# EAGLE design mainBoard (EAGLE 9.5.2)

## Sheet 1 of 2: Master
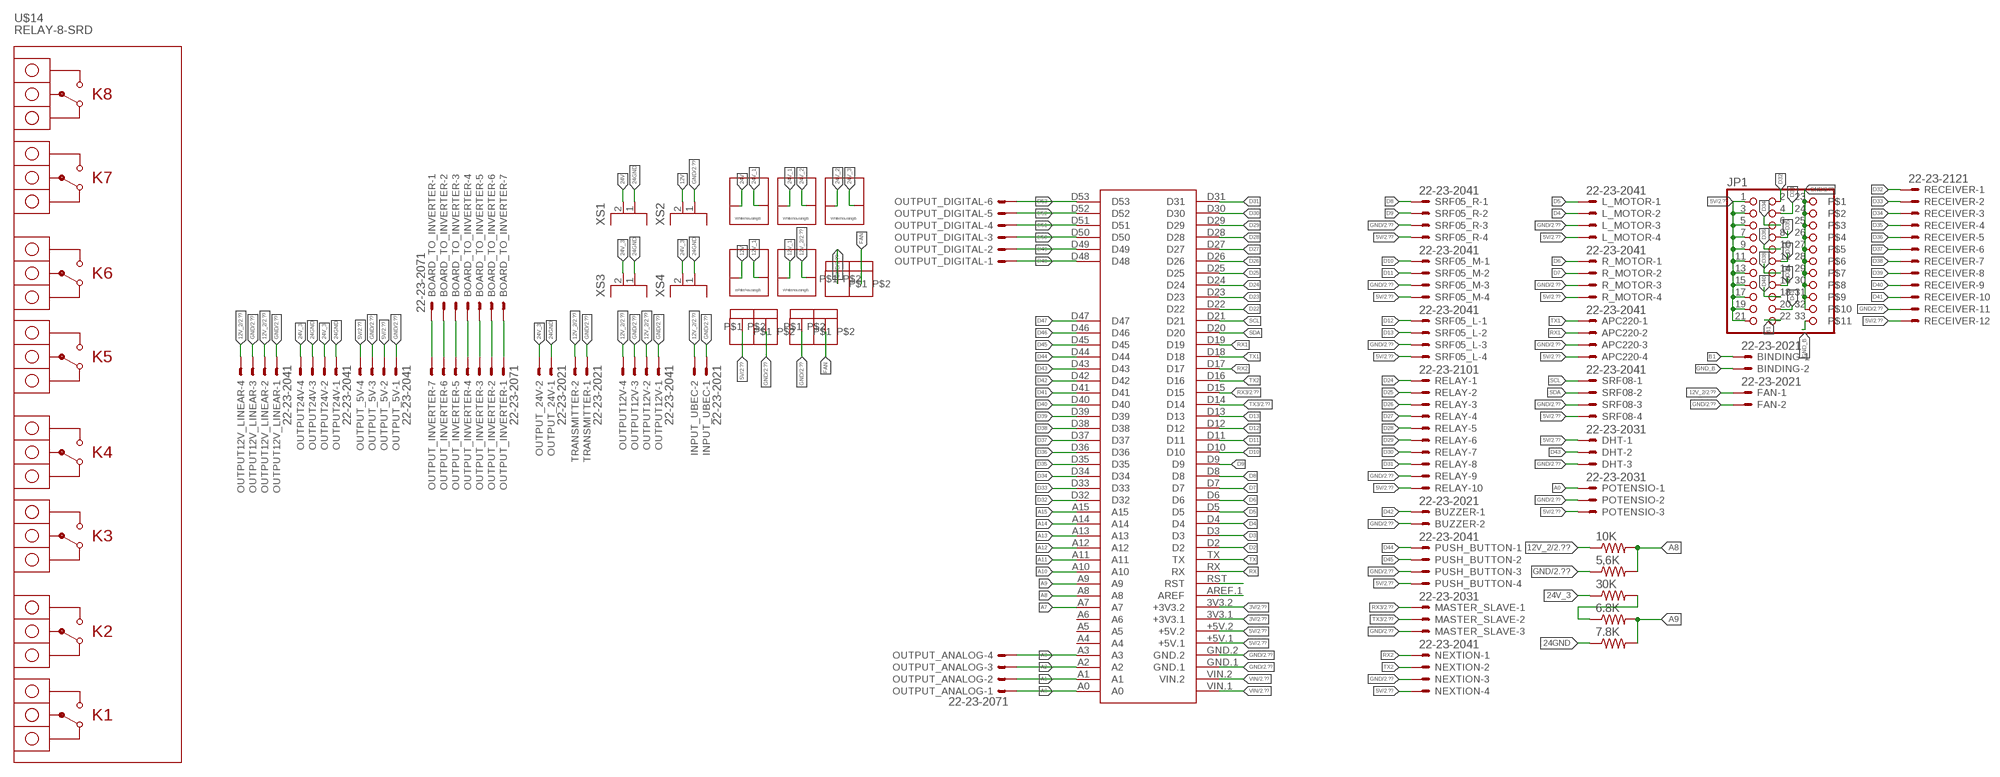
[diagram p0: schematic, sheet 1]

### Parts
5,6K  R-US_0207/7  [0207/7]
6.8K  R-US_0207/7  [0207/7]
7.8K  R-US_0207/7  [0207/7]
10K  R-US_0207/7  [0207/7]
30K  R-US_0207/7  [0207/7]
APC220  22-23-2041  [22-23-2041]
BINDING  22-23-2021  [22-23-2021]
BOARD_TO_INVERTER  22-23-2071  [22-23-2071]
BUZZER  22-23-2021  [22-23-2021]
DHT  22-23-2031  [22-23-2031]
EMERGENCY  WHB  [WHB]
FAN  22-23-2021  [22-23-2021]
FANLEFT  TERMINALBLOCK5MM  [TERMINALBLOCK5MM]
FANRIGHT  TERMINALBLOCK5MM  [TERMINALBLOCK5MM]
FUSE12V  WHB  [WHB]
FUSE24V  WHB  [WHB]
INPUT_UBEC  22-23-2021  [22-23-2021]
JP1  PINHD-2X11  [2X11]
L_MOTOR  22-23-2041  [22-23-2041]
MASTER_SLAVE  22-23-2031  [22-23-2031]
NEXTION  22-23-2041  [22-23-2041]
OUTPUT12V  22-23-2041  [22-23-2041]
OUTPUT12V_LINEAR  22-23-2041  [22-23-2041]
OUTPUT24V  22-23-2041  [22-23-2041]
OUTPUT_5V  22-23-2041  [22-23-2041]
OUTPUT_24V  22-23-2021  [22-23-2021]
OUTPUT_ANALOG  22-23-2071  [22-23-2071]
OUTPUT_DIGITAL  22-23-2061  [22-23-2061]
OUTPUT_INVERTER  22-23-2071  [22-23-2071]
POTENSIO  22-23-2031  [22-23-2031]
PUSH_BUTTON  22-23-2041  [22-23-2041]
R_MOTOR  22-23-2041  [22-23-2041]
RECEIVER  22-23-2121  [22-23-2121]
RELAY  22-23-2101  [22-23-2101]
SRF05_L  22-23-2041  [22-23-2041]
SRF05_M  22-23-2041  [22-23-2041]
SRF05_R  22-23-2041  [22-23-2041]
SRF08  22-23-2041  [22-23-2041]
SWITCH24V  WHB  [WHB]
SWTICH12V  WHB  [WHB]
TRANSMITTER  22-23-2021  [22-23-2021]
U$1  MEGA2560_MIKRO  [MEGA2560_MIKRO]
U$14  RELAY-8-SRD  [RELAY-8-SRD]
UBEC_OUTPUT  TERMINALBLOCK5MM  [TERMINALBLOCK5MM]
XS1  2P  [DG55CB-2P-1]
XS2  2P  [DG55CB-2P-1]
XS3  2P  [DG55CB-2P-1]
XS4  2P  [DG55CB-2P-1]

### Nets
3V: U$1.3V3.1(+3V3.1) U$1.3V3.2(+3V3.2) ; also sheet 2
5V: APC220.4 DHT.1 JP1.1 JP1.3 JP1.5 JP1.7 JP1.9 JP1.11 JP1.13 JP1.15 JP1.17 JP1.19 JP1.21 L_MOTOR.4 NEXTION.4 OUTPUT_5V.2 OUTPUT_5V.4 POTENSIO.3 PUSH_BUTTON.4 R_MOTOR.4 RECEIVER.12 RELAY.10 SRF05_L.4 SRF05_M.4 SRF05_R.4 SRF08.4 U$1.+5V.1 U$1.+5V.2 UBEC_OUTPUT.P$1 ; also sheet 2
12V: FUSE12V.P$1 XS2.2
12V_1: FUSE12V.P$2 SWTICH12V.P$1
12V_2: 10K.1 FAN.1 INPUT_UBEC.2 OUTPUT12V.2 OUTPUT12V.4 OUTPUT12V_LINEAR.2 OUTPUT12V_LINEAR.4 SWTICH12V.P$2 TRANSMITTER.2 ; also sheet 2
24GND: 7.8K.1 OUTPUT24V.1 OUTPUT24V.3 OUTPUT_24V.1 XS1.1 XS3.1 XS4.1
24V: FUSE24V.P$1 XS1.2
24V_1: FUSE24V.P$2 SWITCH24V.P$1
24V_2: EMERGENCY.P$1 SWITCH24V.P$2
24V_3: 30K.1 EMERGENCY.P$2 OUTPUT24V.2 OUTPUT24V.4 OUTPUT_24V.2 XS3.2 XS4.2
A0: OUTPUT_ANALOG.1 POTENSIO.1 U$1.A0
A1: OUTPUT_ANALOG.2 U$1.A1
A2: OUTPUT_ANALOG.3 U$1.A2
A3: OUTPUT_ANALOG.4 U$1.A3
A7: U$1.A7
A8: 5,6K.2 10K.2 U$1.A8
A9: 6.8K.2 7.8K.2 U$1.A9
A10: U$1.A10
A11: U$1.A11
A12: U$1.A12
A13: U$1.A13
A14: U$1.A14
A15: U$1.A15
B1: BINDING.1 JP1.22
D2: U$1.D2
D3: U$1.D3
D4: L_MOTOR.2 U$1.D4
D5: L_MOTOR.1 U$1.D5
D6: R_MOTOR.1 U$1.D6
D7: R_MOTOR.2 U$1.D7
D8: SRF05_R.1 U$1.D8
D9: SRF05_R.2 U$1.D9
D10: SRF05_M.1 U$1.D10
D11: SRF05_M.2 U$1.D11
D12: SRF05_L.1 U$1.D12
D13: SRF05_L.2 U$1.D13
D22: U$1.D22
D23: U$1.D23
D24: RELAY.1 U$1.D24
D25: RELAY.2 U$1.D25
D26: RELAY.3 U$1.D26
D27: RELAY.4 U$1.D27
D28: RELAY.5 U$1.D28
D29: RELAY.6 U$1.D29
D30: RELAY.7 U$1.D30
D31: RELAY.8 U$1.D31
D32: JP1.2 RECEIVER.1 U$1.D32
D33: JP1.4 RECEIVER.2 U$1.D33
D34: JP1.6 RECEIVER.3 U$1.D34
D35: JP1.8 RECEIVER.4 U$1.D35
D36: JP1.10 RECEIVER.5 U$1.D36
D37: JP1.12 RECEIVER.6 U$1.D37
D38: JP1.14 RECEIVER.7 U$1.D38
D39: JP1.16 RECEIVER.8 U$1.D39
D40: JP1.18 RECEIVER.9 U$1.D40
D41: JP1.20 RECEIVER.10 U$1.D41
D42: BUZZER.1 U$1.D42
D43: DHT.2 U$1.D43
D44: PUSH_BUTTON.1 U$1.D44
D45: PUSH_BUTTON.2 U$1.D45
D46: U$1.D46
D47: U$1.D47
D48: OUTPUT_DIGITAL.1 U$1.D48
D49: OUTPUT_DIGITAL.2 U$1.D49
D50: OUTPUT_DIGITAL.3 U$1.D50
D51: OUTPUT_DIGITAL.4 U$1.D51
D52: OUTPUT_DIGITAL.5 U$1.D52
D53: OUTPUT_DIGITAL.6 U$1.D53
FAN: FANLEFT.P$2 FANRIGHT.P$2
GND: 5,6K.1 APC220.3 BUZZER.2 DHT.3 FAN.2 FANLEFT.P$1 FANRIGHT.P$1 INPUT_UBEC.1 JP1.23 JP1.24 JP1.25 JP1.26 JP1.27 JP1.28 JP1.29 JP1.30 JP1.31 JP1.32 L_MOTOR.3 MASTER_SLAVE.3 NEXTION.3 OUTPUT12V.1 OUTPUT12V.3 OUTPUT12V_LINEAR.1 OUTPUT12V_LINEAR.3 OUTPUT_5V.1 OUTPUT_5V.3 POTENSIO.2 PUSH_BUTTON.3 R_MOTOR.3 RECEIVER.11 RELAY.9 SRF05_L.3 SRF05_M.3 SRF05_R.3 SRF08.3 TRANSMITTER.1 U$1.GND.1 U$1.GND.2 UBEC_OUTPUT.P$2 XS2.1 ; also sheet 2
GND_B: BINDING.2 JP1.33
N$3: 6.8K.1 30K.2
N$5: BOARD_TO_INVERTER.1 OUTPUT_INVERTER.7
N$6: BOARD_TO_INVERTER.2 OUTPUT_INVERTER.6
N$7: BOARD_TO_INVERTER.3 OUTPUT_INVERTER.5
N$8: BOARD_TO_INVERTER.4 OUTPUT_INVERTER.4
N$9: BOARD_TO_INVERTER.5 OUTPUT_INVERTER.3
N$10: BOARD_TO_INVERTER.6 OUTPUT_INVERTER.2
N$11: BOARD_TO_INVERTER.7 OUTPUT_INVERTER.1
N$33: U$1.RST
N$34: U$1.AREF.1(AREF)
RX: U$1.RX
RX1: APC220.2 U$1.D19
RX2: NEXTION.1 U$1.D17
RX3: MASTER_SLAVE.1 U$1.D15 ; also sheet 2
SCL: SRF08.1 U$1.D21
SDA: SRF08.2 U$1.D20
TX: U$1.TX
TX1: APC220.1 U$1.D18
TX2: NEXTION.2 U$1.D16
TX3: MASTER_SLAVE.2 U$1.D14 ; also sheet 2
VIN: U$1.VIN.1 U$1.VIN.2 ; also sheet 2
Unconnected: OUTPUT_ANALOG.5 OUTPUT_ANALOG.6 OUTPUT_ANALOG.7 U$1.A4 U$1.A5 U$1.A6

## Sheet 2 of 2: SLAVE
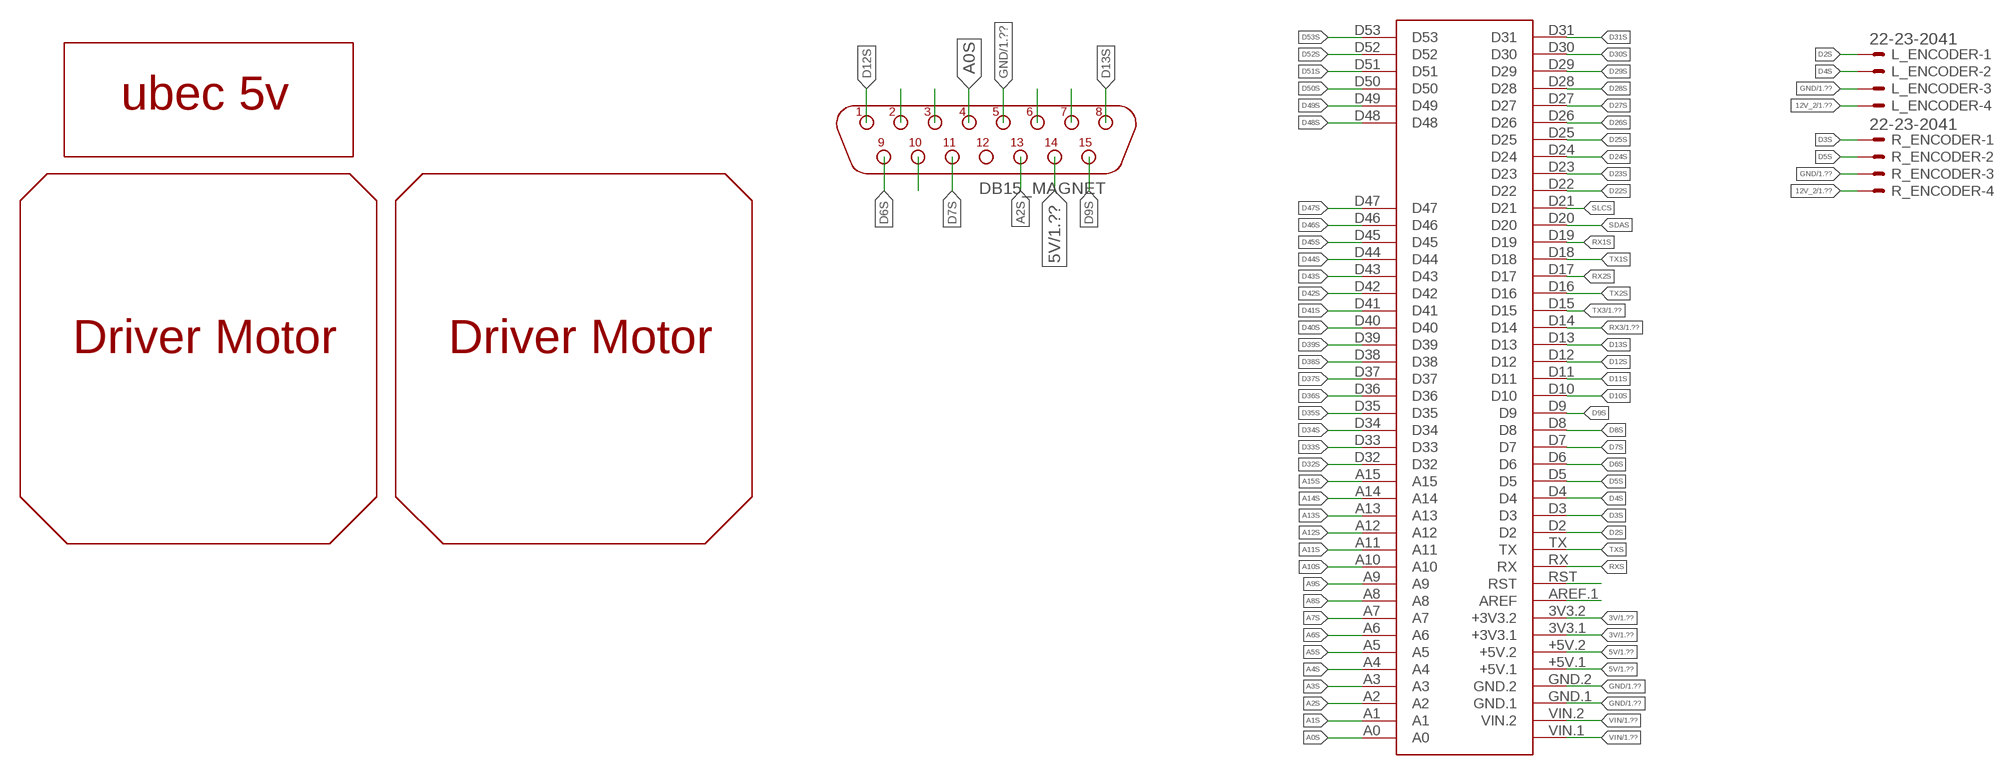
[diagram p1: schematic, sheet 2]

### Parts
DB15_MAGNET  DB15M/90  [D-15M/90]
L_ENCODER  22-23-2041  [22-23-2041]
R_ENCODER  22-23-2041  [22-23-2041]
U$2  MEGA2560_MIKRO  [MEGA2560_MIKRO]
U$11  BT2  [IBT2]
U$12  BT2  [IBT2]
U$13  UBEC  [AD]

### Nets
3V: U$2.3V3.1(+3V3.1) U$2.3V3.2(+3V3.2) ; also sheet 1
5V: DB15_MAGNET.14 U$2.+5V.1 U$2.+5V.2 ; also sheet 1
12V_2: L_ENCODER.4 R_ENCODER.4 ; also sheet 1
A0S: DB15_MAGNET.4 U$2.A0
A1S: U$2.A1
A2S: DB15_MAGNET.13 U$2.A2
A3S: U$2.A3
A4S: U$2.A4
A5S: U$2.A5
A6S: U$2.A6
A7S: U$2.A7
A8S: U$2.A8
A9S: U$2.A9
A10S: U$2.A10
A11S: U$2.A11
A12S: U$2.A12
A13S: U$2.A13
A14S: U$2.A14
A15S: U$2.A15
D2S: L_ENCODER.1 U$2.D2
D3S: R_ENCODER.1 U$2.D3
D4S: L_ENCODER.2 U$2.D4
D5S: R_ENCODER.2 U$2.D5
D6S: DB15_MAGNET.9 U$2.D6
D7S: DB15_MAGNET.11 U$2.D7
D8S: U$2.D8
D9S: DB15_MAGNET.15 U$2.D9
D10S: U$2.D10
D11S: U$2.D11
D12S: DB15_MAGNET.1 U$2.D12
D13S: DB15_MAGNET.8 U$2.D13
D22S: U$2.D22
D23S: U$2.D23
D24S: U$2.D24
D25S: U$2.D25
D26S: U$2.D26
D27S: U$2.D27
D28S: U$2.D28
D29S: U$2.D29
D30S: U$2.D30
D31S: U$2.D31
D32S: U$2.D32
D33S: U$2.D33
D34S: U$2.D34
D35S: U$2.D35
D36S: U$2.D36
D37S: U$2.D37
D38S: U$2.D38
D39S: U$2.D39
D40S: U$2.D40
D41S: U$2.D41
D42S: U$2.D42
D43S: U$2.D43
D44S: U$2.D44
D45S: U$2.D45
D46S: U$2.D46
D47S: U$2.D47
D48S: U$2.D48
D49S: U$2.D49
D50S: U$2.D50
D51S: U$2.D51
D52S: U$2.D52
D53S: U$2.D53
GND: DB15_MAGNET.5 L_ENCODER.3 R_ENCODER.3 U$2.GND.1 U$2.GND.2 ; also sheet 1
N$1: U$2.RST
N$2: U$2.AREF.1(AREF)
N$4: DB15_MAGNET.3
N$20: DB15_MAGNET.2
N$25: DB15_MAGNET.6
N$26: DB15_MAGNET.7
N$41: DB15_MAGNET.10
RX1S: U$2.D19
RX2S: U$2.D17
RX3: U$2.D14 ; also sheet 1
RXS: U$2.RX
SDAS: U$2.D20
SLCS: U$2.D21
TX1S: U$2.D18
TX2S: U$2.D16
TX3: U$2.D15 ; also sheet 1
TXS: U$2.TX
VIN: U$2.VIN.1 U$2.VIN.2 ; also sheet 1
Unconnected: DB15_MAGNET.12

## Library data of the parts
5,6K 6.8K 7.8K 10K 30K = rcl:R-US_: RESISTOR, American symbol; SPICEPREFIX: R
APC220 L_ENCODER L_MOTOR NEXTION OUTPUT12V OUTPUT12V_LINEAR OUTPUT24V OUTPUT_5V PUSH_BUTTON R_ENCODER R_MOTOR SRF05_L SRF05_M SRF05_R SRF08 = con-molex:22-23-2041: .100" (2.54mm) Center Header - 4 Pin; MF: MOLEX; MPN: 22-23-2041; OC_FARNELL: 1462920; OC_NEWARK: 38C0355
BINDING BUZZER FAN INPUT_UBEC OUTPUT_24V TRANSMITTER = con-molex:22-23-2021: .100" (2.54mm) Center Header - 2 Pin; MF: MOLEX; MPN: 22-23-2021; OC_FARNELL: 1462926; OC_NEWARK: 25C3832
BOARD_TO_INVERTER OUTPUT_ANALOG OUTPUT_INVERTER = con-molex:22-23-2071: .100" (2.54mm) Center Header - 7 Pin; MF: MOLEX; MPN: 22-23-2071; OC_FARNELL: 1654534; OC_NEWARK: 56H0445
DB15_MAGNET = connect:DB15M/90
DHT MASTER_SLAVE POTENSIO = con-molex:22-23-2031: .100" (2.54mm) Center Header - 3 Pin; MF: MOLEX; MPN: 22-23-2031; OC_FARNELL: 1462950; OC_NEWARK: 30C0862
EMERGENCY FUSE12V FUSE24V SWITCH24V SWTICH12V = WhiteHousingB:WHB
FANLEFT FANRIGHT UBEC_OUTPUT = terminal5mm:TERMINALBLOCK5MM
JP1 = pinhead:PINHD-2X11: PIN HEADER
OUTPUT_DIGITAL = con-molex:22-23-2061: .100" (2.54mm) Center Header - 6 Pin; MF: MOLEX; MPN: 22-23-2061; OC_FARNELL: 1462922; OC_NEWARK: 27C1933
RECEIVER = con-molex:22-23-2121: .100" (2.54mm) Center Header - 12 Pin; MF: MOLEX; MPN: 22-23-2121; OC_FARNELL: 1462935; OC_NEWARK: 56H0456
RELAY = con-molex:22-23-2101: .100" (2.54mm) Center Header - 10 Pin; MF: MOLEX; MPN: 22-23-2101; OC_FARNELL: 1756828; OC_NEWARK: 94C0765
U$1 U$2 = MIKRO_MEGA2560:MEGA2560_MIKRO: Arduino Mega2560 pro robotDyn, create by mikroavr.com
U$11 U$12 = bt2DM:BT2
U$13 = UBEC:UBEC
U$14 = diy-modules:RELAY-8-SRD: 8-Channel Relay Module based on SRD-05VDC-SL-C relays Click here to find device on ebay.com <http://www.ebay.com/sch/eight+channel+relay+module+optocoupler+5v>
XS1-XS4 = con-dg55:2P: DEGSON DG55 CONNECTOR

## Board
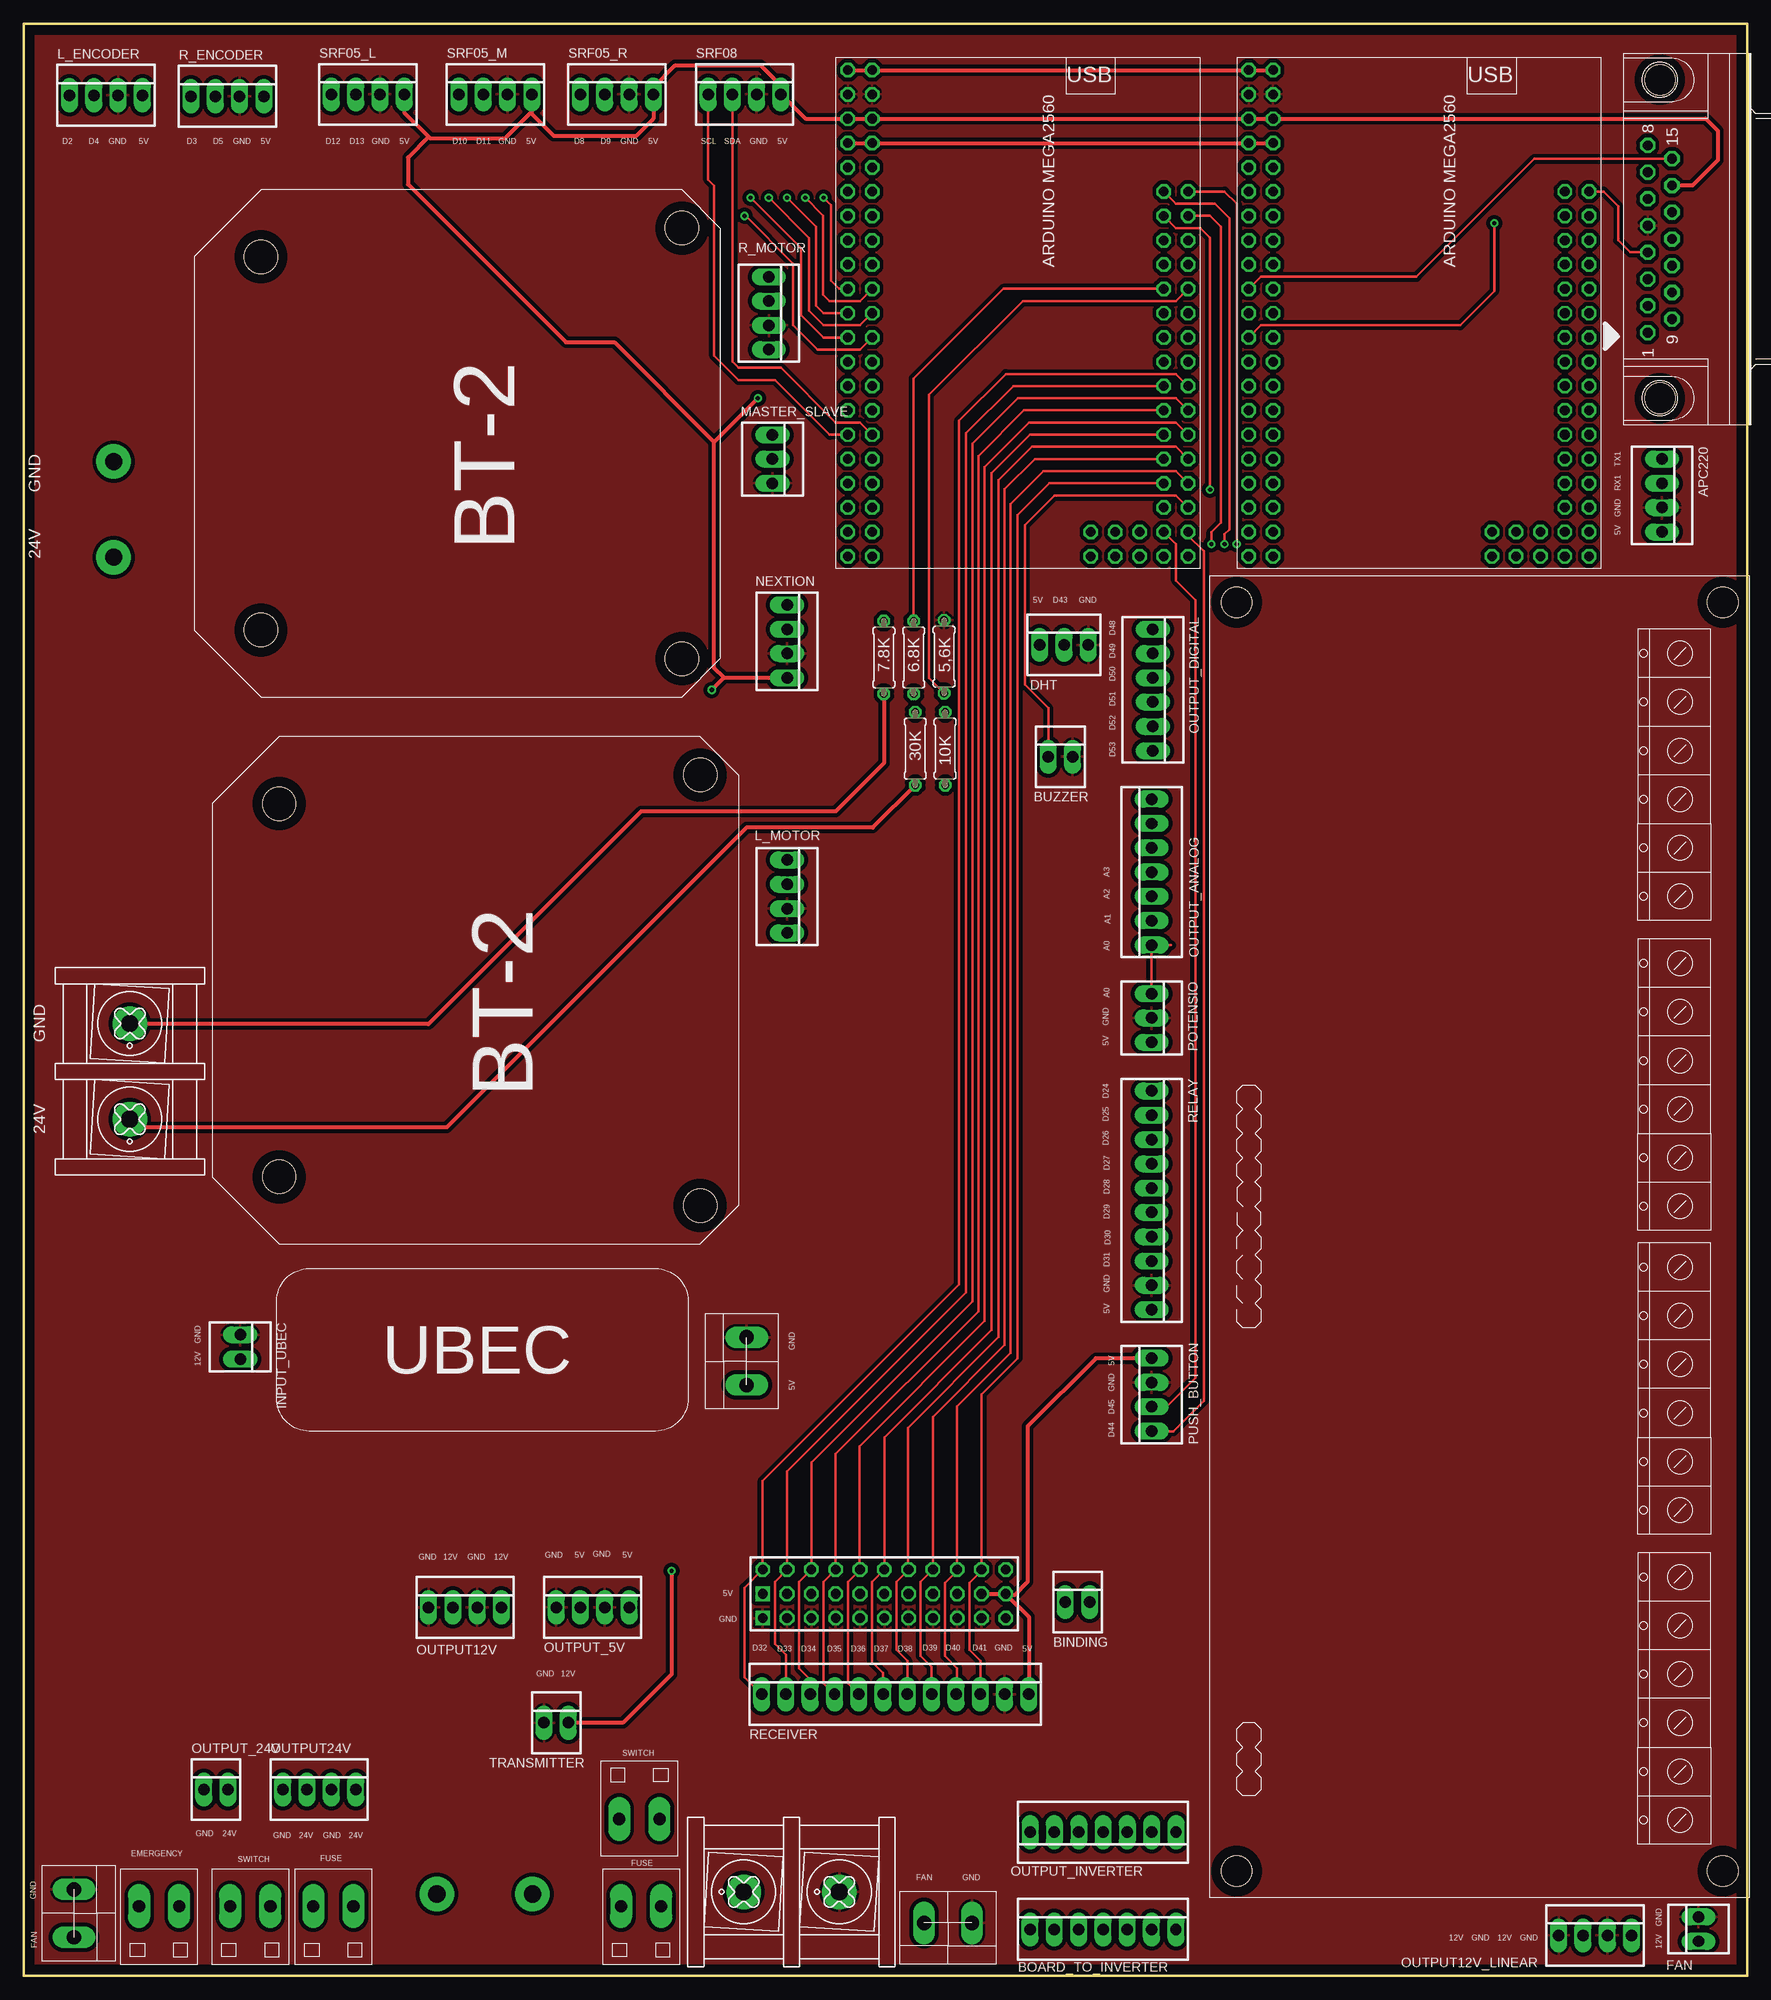
[diagram p2: board, top side]
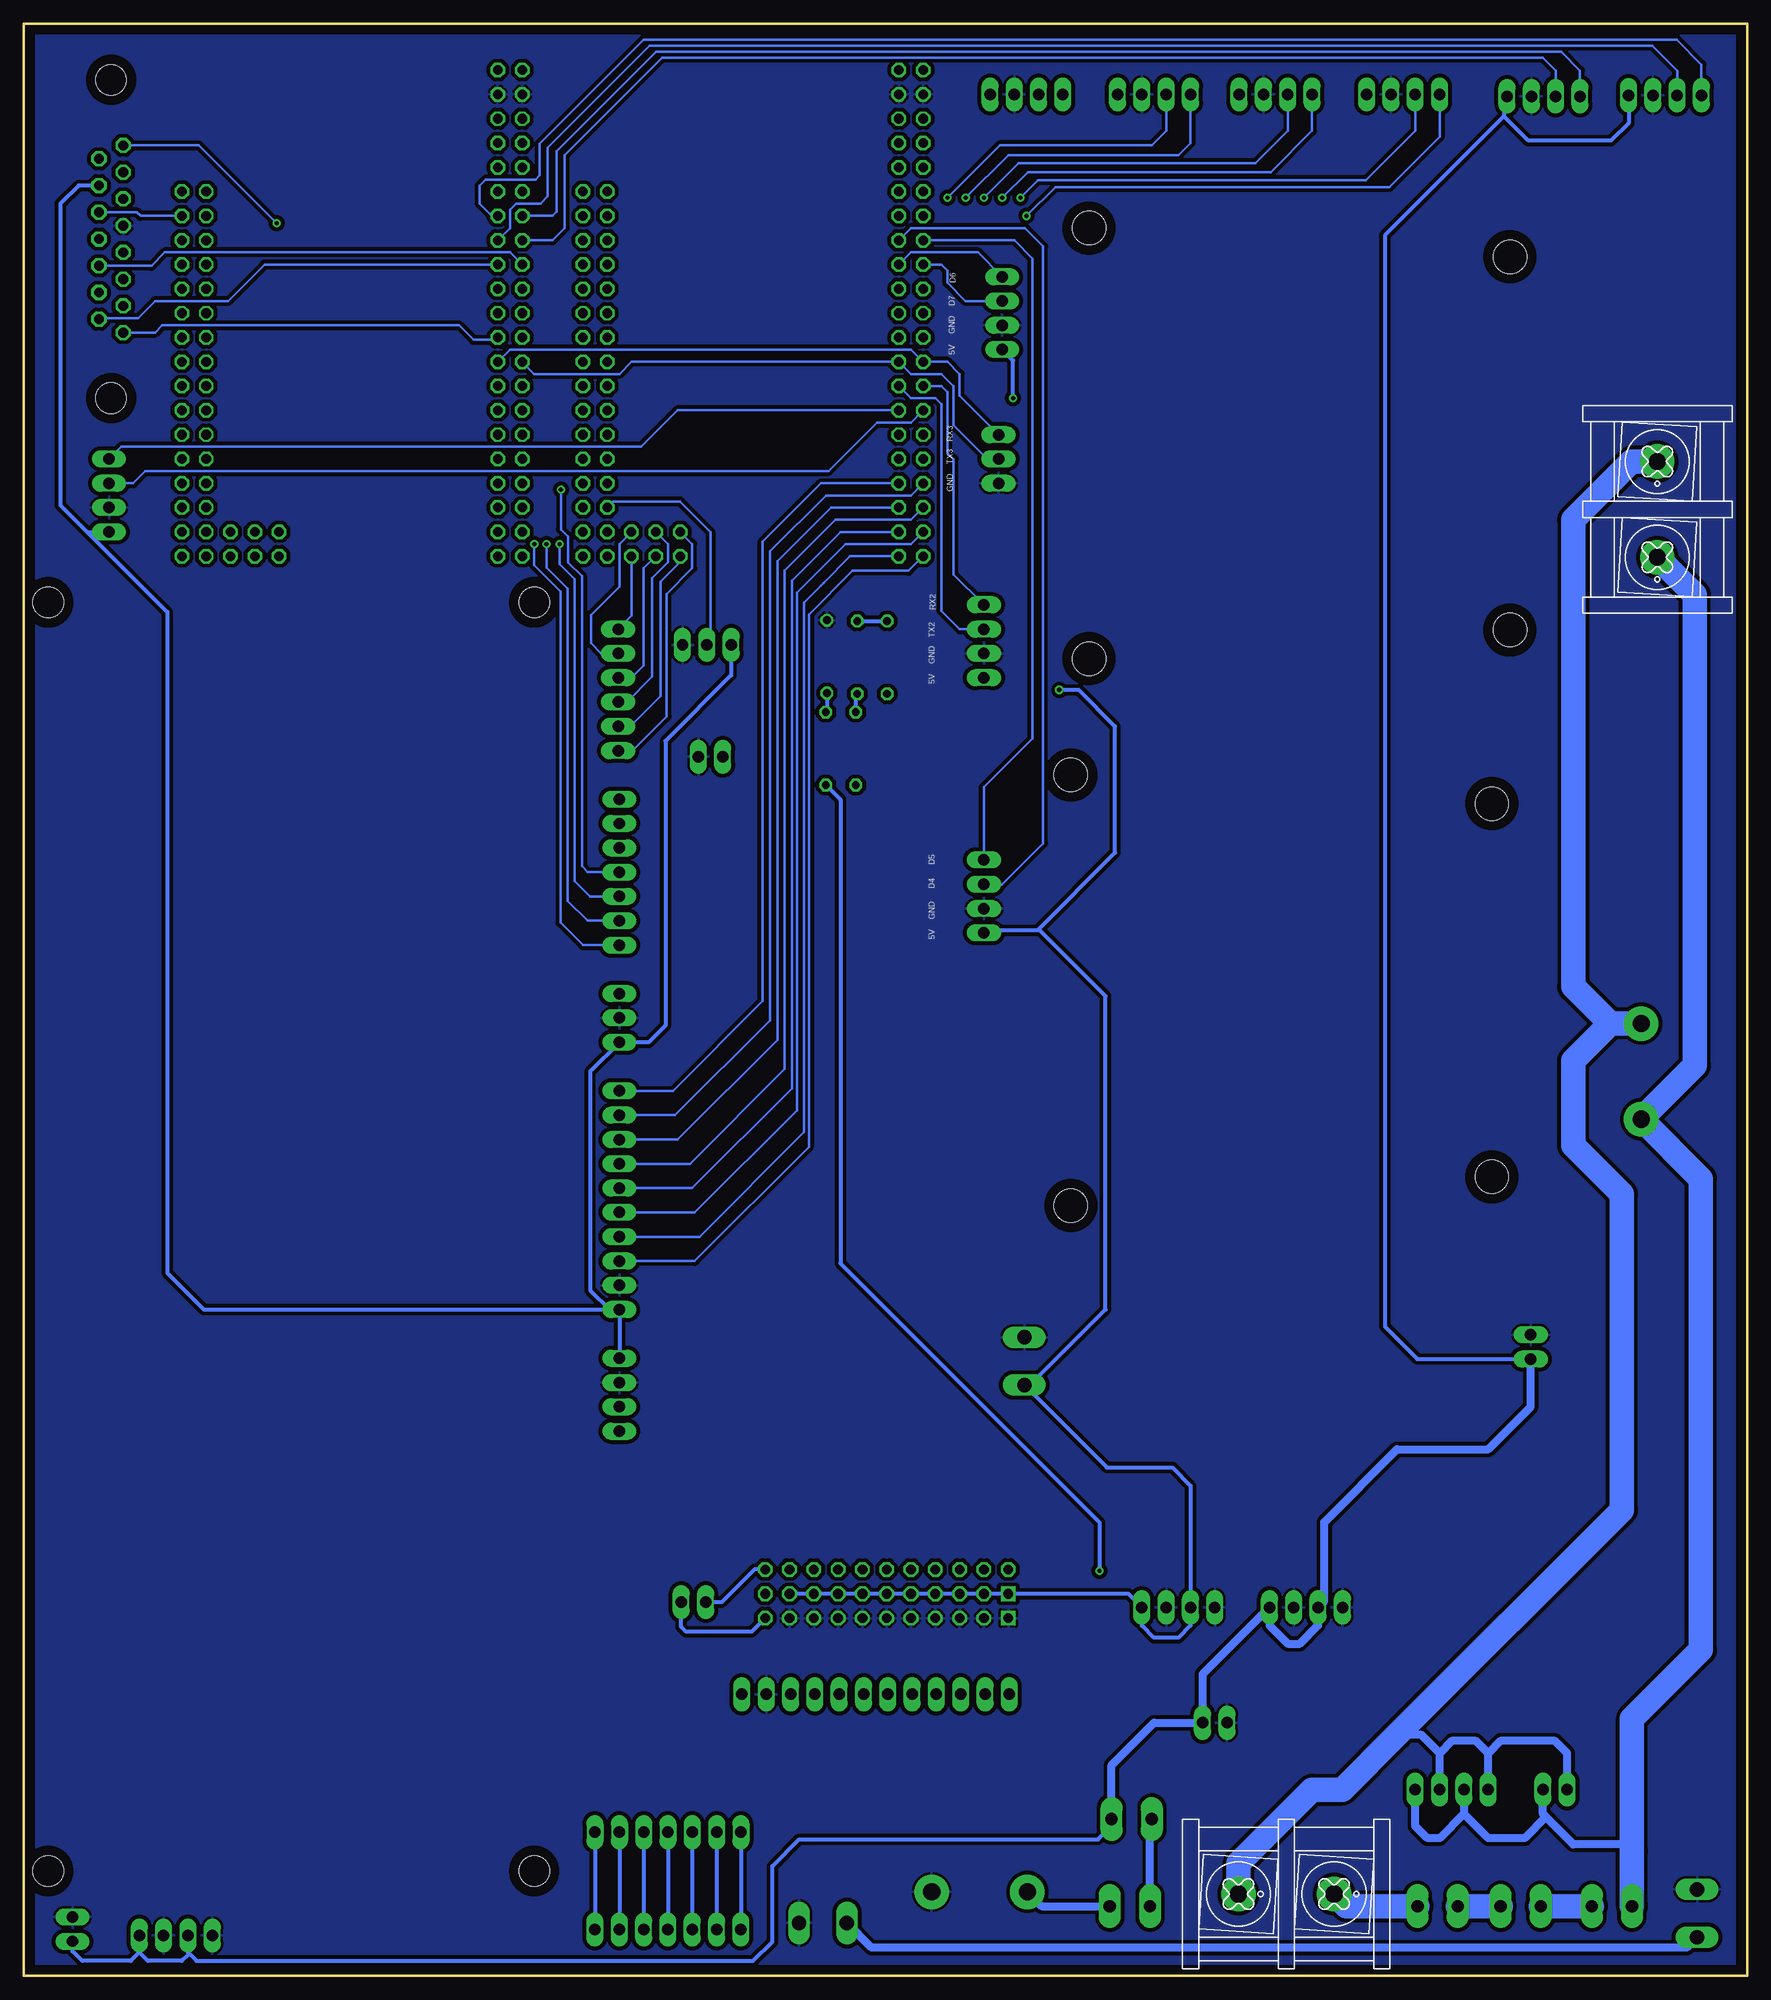
[diagram p3: board, bottom side, seen from below]

Size 180.09 x 203.96 mm. Coordinates in mm from the lower left corner, seen from the top.
Outline: 0,203.96 180.09,203.96 180.09,0 0,0 0,203.96
Copper layers (1*16): Top 0.035mm / dielectric 1.5mm / Bottom 0.035mm
Design rules "default": minimum track width 6mil, minimum drill 0.35mm, track to track 6mil, track to pad 6mil, pad to pad 6mil, via to via 6mil, smd to smd 6mil, copper to edge 40mil, drill to drill 6mil, minimum pad ring 10mil, minimum via ring 8mil, stop-mask expansion 4mil, vias tented up to drill 0mil, thermal gap 10mil

### Footprints (pad centres in the part's own frame; a part is rotated, then mirrored left to right if it is on the bottom)
0207/7 = drill 0.813 octagon: 1 -3.81,0; 2 3.81,0
22-23-2041 = drill 1.2 long: 1 -3.81,0; 2 -1.27,0; 3 1.27,0; 4 3.81,0
22-23-2021 = drill 1.2 long: 1 -1.27,0; 2 1.27,0
22-23-2071 = drill 1.2 long: 1 -7.62,0; 2 -5.08,0; 3 -2.54,0; 4 0,0; 5 2.54,0; 6 5.08,0; 7 7.62,0
D-15M/90 = drill 1.016 pad 1.575 octagon: 1 9.779,-1.27; 2 6.985,-1.27; 3 4.191,-1.27; 4 1.397,-1.27; 5 -1.397,-1.27; 6 -4.191,-1.27; 7 -6.985,-1.27; 8 -9.779,-1.27; 9 8.382,1.27; 10 5.588,1.27; 11 2.794,1.27; 12 0,1.27; 13 -2.794,1.27; 14 -5.588,1.27; 15 -8.382,1.27 | hole 3.2: 16.637,0; -16.637,0
22-23-2031 = drill 1.2 long: 1 -2.54,0; 2 0,0; 3 2.54,0
WHB = drill 1.27 pad 2.286 long: P$1 1.9,-6.1; P$2 6.1,-6.1
TERMINALBLOCK5MM = drill 1.5 long: P$1 0,0; P$2 5,0
2X11 = drill 1.016 square: 1 -12.7,-1.27; 23 -12.7,-3.81 | drill 1.016 octagon: 2 -12.7,1.27; 3 -10.16,-1.27; 4 -10.16,1.27; 5 -7.62,-1.27; 6 -7.62,1.27; 7 -5.08,-1.27; 8 -5.08,1.27; 9 -2.54,-1.27; 10 -2.54,1.27; 11 0,-1.27; 12 0,1.27; 13 2.54,-1.27; 14 2.54,1.27; 15 5.08,-1.27; 16 5.08,1.27; 17 7.62,-1.27; 18 7.62,1.27; 19 10.16,-1.27; 20 10.16,1.27; 21 12.7,-1.27; 22 12.7,1.27; 24 -10.16,-3.81; 25 -7.62,-3.81; 26 -5.08,-3.81; 27 -2.54,-3.81; 28 0,-3.81; 29 2.54,-3.81; 30 5.08,-3.81; 31 7.62,-3.81; 32 10.16,-3.81; 33 12.7,-3.81
22-23-2061 = drill 1.2 long: 1 -6.35,0; 2 -3.81,0; 3 -1.27,0; 4 1.27,0; 5 3.81,0; 6 6.35,0
22-23-2121 = drill 1.2 long: 1 -13.97,0; 2 -11.43,0; 3 -8.89,0; 4 -6.35,0; 5 -3.81,0; 6 -1.27,0; 7 1.27,0; 8 3.81,0; 9 6.35,0; 10 8.89,0; 11 11.43,0; 12 13.97,0
22-23-2101 = drill 1.2 long: 1 -11.43,0; 2 -8.89,0; 3 -6.35,0; 4 -3.81,0; 5 -1.27,0; 6 1.27,0; 7 3.81,0; 8 6.35,0; 9 8.89,0; 10 11.43,0
MEGA2560_MIKRO = drill 1 octagon: 3V3.1 -26.67,-17.78; 3V3.2 -26.67,-20.32; +5V.1 -29.21,-17.78; +5V.2 -29.21,-20.32; A0 -21.59,15.24; A1 -21.59,12.7; A2 -19.05,15.24; A3 -19.05,12.7; A4 -16.51,15.24; A5 -16.51,12.7; A6 -13.97,15.24; A7 -13.97,12.7; A8 -11.43,15.24; A9 -11.43,12.7; A10 -8.89,15.24; A11 -8.89,12.7; A12 -6.35,15.24; A13 -6.35,12.7; A14 -3.81,15.24; A15 -3.81,12.7; AREF.1 -24.13,-17.78; D2 -19.05,-17.78; D3 -19.05,-20.32; D4 -16.51,-17.78; D5 -16.51,-20.32; D6 -13.97,-17.78; D7 -13.97,-20.32; D8 -11.43,-17.78; D9 -11.43,-20.32; D10 -8.89,-17.78; D11 -8.89,-20.32; D12 -6.35,-17.78; D13 -6.35,-20.32; D14 -3.81,-17.78; D15 -3.81,-20.32; D16 -1.27,-17.78; D17 -1.27,-20.32; D18 1.27,-17.78; D19 1.27,-20.32; D20 3.81,-17.78; D21 3.81,-20.32; D22 6.35,-17.78; D23 6.35,-20.32; D24 8.89,-17.78; D25 8.89,-20.32; D26 11.43,-17.78; D27 11.43,-20.32; D28 13.97,-17.78; D29 13.97,-20.32; D30 16.51,-17.78; D31 16.51,-20.32; D32 -1.27,15.24; D33 -1.27,12.7; D34 1.27,15.24; D35 1.27,12.7; D36 3.81,15.24; D37 3.81,12.7; D38 6.35,15.24; D39 6.35,12.7; D40 8.89,15.24; D41 8.89,12.7; D42 11.43,15.24; D43 11.43,12.7; D44 13.97,15.24; D45 13.97,12.7; D46 16.51,15.24; D47 16.51,12.7; D48 16.51,10.16; D49 13.97,10.16; D50 16.51,7.62; D51 13.97,7.62; D52 16.51,5.08; D53 13.97,5.08; GND.1 -31.75,-17.78; GND.2 -31.75,-20.32; RST -24.13,-20.32; RX -21.59,-17.78; TX -21.59,-20.32; VIN.1 -34.29,-17.78; VIN.2 -34.29,-20.32
IBT2 = hole 3.5: 0,-4; 45,-4; 42,-48; 3,-48
RELAY-8-SRD = hole 3.2: -25.4,66.294; 25.4,66.294; 25.4,-66.294; -25.4,-66.294
DG55CB-2P-1 = drill 1.8 pad 3.6: 1 -5,0; 2 5,0

### Placement (x,y rotation side)
5,6K  96.17,137.84 270 top
6.8K  92.99,137.75 90 top
7.8K  89.87,137.75 90 top
10K  96.28,128.23 90 top
30K  93.16,128.23 90 top
APC220  171.2,154.69 270 top
BINDING  110.12,39.03 0 top
BOARD_TO_INVERTER  112.78,4.83 0 top
BUZZER  108.33,127.38 0 top
DB15_MAGNET  170.98,181.49 270 top
DHT  108.71,139.06 0 top
EMERGENCY  18.13,1.16 180 top
FAN  175.01,4.86 90 top
FANLEFT  99.08,5.5 180 top
FANRIGHT  5.22,9 270 top
FUSE12V  68.51,1.16 180 top
FUSE24V  36.34,1.16 180 top
INPUT_UBEC  22.61,65.71 270 top
JP1  89.92,41.17 0 top
L_ENCODER  8.58,196.51 0 top
L_MOTOR  79.76,112.78 270 top
MASTER_SLAVE  78.23,158.5 270 top
NEXTION  79.76,139.45 270 top
OUTPUT12V  46.1,38.48 0 top
OUTPUT12V_LINEAR  164.21,4.19 0 top
OUTPUT24V  30.86,19.43 0 top
OUTPUT_5V  59.44,38.48 0 top
OUTPUT_24V  20.07,19.43 0 top
OUTPUT_ANALOG  117.86,115.32 90 top
OUTPUT_DIGITAL  117.98,134.37 270 top
OUTPUT_INVERTER  112.78,14.99 180 top
POTENSIO  117.86,100.08 270 top
PUSH_BUTTON  117.86,60.71 90 top
R_ENCODER  21.28,196.4 0 top
R_MOTOR  77.85,173.74 270 top
RECEIVER  91.07,29.4 0 top
RELAY  117.86,81.03 270 top
SRF05_L  35.94,196.6 0 top
SRF05_M  49.28,196.6 0 top
SRF05_R  61.98,196.6 0 top
SRF08  75.31,196.6 0 top
SWITCH24V  27.66,1.16 180 top
SWTICH12V  60.32,22.47 0 top
TRANSMITTER  55.63,26.42 0 top
U$1  106.43,164.85 270 top
U$2  148.34,164.85 270 top
U$11  72.77,182.63 270 top
U$12  74.68,125.48 270 top
U$13  26.42,56.9 0 top
U$14  152.15,77.22 180 top
UBEC_OUTPUT  75.53,61.71 90 top
XS1  48.16,8.53 0 bottom
XS2  80.22,8.75 180 top
XS3  11.07,94.5 270 top
XS4  9.38,153.23 270 bottom

### Tracks (layer width: path | path; a pad name or v marks a point on that pad's centre or on a via)
3V
  Top 0.406: U$1.3V3.2 U$1.3V3.1 U$2.3V3.2 U$2.3V3.1
5V  (via drill 0.45)
  Top 0.406: 102.75,39.76 JP1.21 JP1.19 | 102.75,39.76 105.04,37.48 RECEIVER.12 | PUSH_BUTTON.4 112.01,64.52 104.9,57.4 104.9,41.15 103.51,39.76 102.75,39.76 | v71.88,134.37 73.15,135.64 | 73.15,135.64 NEXTION.4 | 72.14,160.27 72.14,136.65 73.15,135.64 | 72.14,160.27 v76.71,164.85 | SRF05_L.4 39.75,194.69 42.29,192.15 | 42.29,192.15 42.42,192.02 50.29,192.02 52.96,194.69 | SRF05_M.4 53.09,194.82 52.96,194.69 | 52.96,194.69 55.37,192.28 64.01,192.28 65.79,194.06 SRF05_R.4 65.79,197.36 68.07,199.64 76.96,199.64 79.12,197.49 SRF08.4 81.66,194.06 U$1.+5V.2 U$1.+5V.1 U$2.+5V.2 U$2.+5V.1 175.77,194.06 177.04,192.79 177.04,189.74 174.37,187.07 DB15_MAGNET.14 | 42.29,192.15 40.13,189.99 40.13,187.2 56.64,170.69 61.72,170.69 72.14,160.27
  Bottom 0.406: JP1.19 JP1.17 JP1.15 JP1.13 JP1.11 JP1.9 JP1.7 JP1.5 JP1.3 JP1.1 64.66,39.9 OUTPUT_5V.4 63.25,36.58 61.98,35.31 59.44,35.31 58.17,36.58 OUTPUT_5V.2 58.17,51.18 60.07,53.09 66.91,53.09 UBEC_OUTPUT.P$1 74.95,61.71 67.06,69.6 67.06,102.36 73.91,109.22 74.17,109.22 | DB15_MAGNET.14 174.37,187.07 176.28,185.17 176.28,153.67 173.48,150.88 | 173.48,150.88 APC220.4 | 173.48,150.88 165.1,142.49 165.1,73.41 161.29,69.6 118.87,69.6 | 118.87,69.6 RELAY.10 PUSH_BUTTON.4 | L_MOTOR.4 79.5,109.22 74.17,109.22 | 74.17,109.22 66.04,117.35 66.04,130.56 69.85,134.37 v71.88,134.37 | v76.71,164.85 76.71,168.78 R_MOTOR.4 | DHT.1 106.17,135.89 113.03,129.03 113.03,99.31 114.81,97.54 POTENSIO.3 120.9,94.49 120.9,71.63 118.87,69.6
12V
  Bottom 0.813: XS2.2 73.73,7.26 FUSE12V.P$1
12V_1
  Bottom 0.813: FUSE12V.P$2 62.41,16.18 SWTICH12V.P$1
12V_2  (via drill 0.45)
  Top 0.406: v67.69,42.29 67.69,31.5 62.61,26.42 TRANSMITTER.2
  Bottom 0.406: v67.69,42.29 67.69,47.37 94.75,74.43 94.75,122.89 10K.1 | OUTPUT12V_LINEAR.2 162.94,2.41 | 162.94,2.41 162.94,2.16 163.58,1.52 167.13,1.52 168.02,2.41 | OUTPUT12V_LINEAR.4 168.02,2.41 | 168.02,2.41 168.91,1.52 173.99,1.52 175.01,2.54 FAN.1 | 162.94,2.41 162.05,1.52 103.89,1.52 101.85,3.56 101.85,11.43 99.06,14.22 67.82,14.22 66.42,15.63 SWTICH12V.P$2 | L_ENCODER.4 12.39,193.61 14.22,191.77 22.86,191.77 25.4,194.31 | 25.4,194.31 25.4,197.1 25.09,196.79 R_ENCODER.4 | INPUT_UBEC.2 34.46,64.44 37.85,67.82 37.85,181.86 25.4,194.31
  Bottom 0.813: SWTICH12V.P$2 66.42,21.98 61.98,26.42 TRANSMITTER.2 56.9,31.5 OUTPUT12V.4 49.91,36.58 48.01,34.67 46.74,34.67 44.83,36.58 OUTPUT12V.2 44.2,39.12 44.2,47.37 36.58,54.99 27.05,54.99 22.61,59.44 INPUT_UBEC.2
24GND
  Top 0.406: 7.8K.1 89.87,126.7 84.84,121.67 64.52,121.67 42.29,99.44 11.12,99.44 XS3.1
  Bottom 0.813: OUTPUT_24V.1 18.8,23.24 20.07,24.51 25.78,24.51 27.05,23.24 | OUTPUT24V.1 27.05,23.24 | 27.05,23.24 28.32,24.51 30.86,24.51 32.13,23.24 | OUTPUT24V.3 32.13,23.24 | 32.13,23.24 34.04,25.15 36.58,25.15
  Bottom 2.54: XS1.1 53.16,11.74 45.47,19.43 42.29,19.43 36.58,25.15 13.08,48.64 13.08,81.66 18.16,86.74 18.16,95.63 14.3,99.5 | XS3.1 14.3,99.5 | 14.3,99.5 18.16,103.36 18.16,152.15 12.08,158.23 XS4.1
24V
  Bottom 2.54: XS1.2 41.89,7.26 FUSE24V.P$1
24V_1
  Bottom 2.54: FUSE24V.P$2 SWITCH24V.P$1
24V_2
  Bottom 2.54: SWITCH24V.P$2 EMERGENCY.P$1
24V_3
  Top 0.406: 30K.1 88.71,119.97 75.52,119.97 44.2,88.65 11.18,88.65 11.07,88.76 XS3.2
  Bottom 0.813: 12.03,13.08 12.66,13.72 18.16,13.72 21.02,16.57 | 21.02,16.57 21.34,16.89 OUTPUT_24V.2 | 21.02,16.57 23.24,14.35 27.05,14.35 29.59,16.89 | OUTPUT24V.2 29.59,16.89 | 29.59,16.89 32.13,14.35 33.4,14.35 34.67,15.62 OUTPUT24V.4
  Bottom 2.54: EMERGENCY.P$2 12.03,13.08 12.03,26.84 4.83,34.04 4.83,83.26 XS3.2 5.46,95.1 5.46,144.31 XS4.2
A0  (via drill 0.45)
  Top 0.254: POTENSIO.1 OUTPUT_ANALOG.1 119.89,107.7 | U$1.A0 125.48,186.44 126.75,185.17 v126.75,149.61
  Bottom 0.254: v126.75,149.61 126.75,147.39 124,144.65 124,110.03 121.67,107.7 OUTPUT_ANALOG.1
A0S
  Top 0.254: U$2.A0 165.1,186.44 166.62,184.91 166.62,181.36 167.89,180.09 DB15_MAGNET.4
A1  (via drill 0.45)
  Top 0.254: U$1.A1 120.4,185.17 124.46,185.17 125.98,183.64 125.98,151.13 125.48,150.62 v125.48,149.61
  Bottom 0.254: OUTPUT_ANALOG.2 121.16,110.24 123.24,112.32 123.24,144.93 125.48,147.17 v125.48,149.61
A2  (via drill 0.45)
  Top 0.254: v124.11,149.61 124.11,150.87 125.08,151.84 125.08,182.77 123.95,183.9 U$1.A2
  Bottom 0.254: OUTPUT_ANALOG.3 120.9,112.78 122.54,114.41 122.54,145.95 124.11,147.52 v124.11,149.61
A2S
  Bottom 0.254: U$2.A2 167.89,183.9 168.28,184.28 DB15_MAGNET.13
A3  (via drill 0.45)
  Top 0.254: U$1.A3 120.4,182.63 122.95,182.63 123.96,181.62 v123.96,155.29
  Bottom 0.254: v123.96,155.29 123.96,151.14 123.19,150.37 123.19,147.67 121.77,146.26 121.77,115.93 121.16,115.32 OUTPUT_ANALOG.4
A8
  Top 0.254: 5,6K.2 94.59,135.61 94.59,165.2 104.39,175.01 120.4,175.01 U$1.A8
  Bottom 0.406: 5,6K.2 96.17,132.15 10K.2
A9
  Top 0.254: U$1.A9 102.36,176.28 92.99,166.91 6.8K.2
  Bottom 0.406: 6.8K.2 7.8K.2
B1
  Bottom 0.406: JP1.22 103.74,42.44 107.15,39.03 BINDING.1
D2S
  Bottom 0.254: L_ENCODER.1 4.77,199.71 7.37,202.31 115.32,202.31 126.18,191.45 126.18,188.14 126.61,187.71 131.83,187.71 132.46,187.07 132.46,185.17 131.19,183.9 U$2.D2
D3S
  Bottom 0.254: R_ENCODER.1 17.47,199.08 19.43,201.04 114.05,201.04 124.41,190.68 124.41,184.33 124.84,183.9 U$2.D3
D4
  Bottom 0.254: L_MOTOR.2 77.85,114.05 73.57,118.33 73.57,180.72 75.47,182.63 87.38,182.63 U$1.D4
D4S
  Bottom 0.254: L_ENCODER.2 7.31,199.07 9.91,201.68 114.68,201.68 125.34,191.02 125.34,185.94 126.11,185.17 128.65,185.17 129.29,184.53 129.29,182.63 U$2.D4
D5
  Bottom 0.254: L_MOTOR.1 79.76,124.21 74.68,129.29 74.68,179.45 76.58,181.36 U$1.D5
D5S
  Bottom 0.254: R_ENCODER.2 20.01,199.08 21.34,200.41 113.41,200.41 123.57,190.25 123.57,182.63 124.84,181.36 U$2.D5
D6
  Bottom 0.254: R_MOTOR.1 80.39,180.09 87.38,180.09 U$1.D6
D6S
  Bottom 0.254: U$2.D6 154.94,178.82 158.75,175.01 166.37,175.01 168.15,173.23 172.72,173.23 172.6,173.1 DB15_MAGNET.9
D7
  Bottom 0.254: R_MOTOR.2 81.66,175.01 83.57,176.91 83.57,178.18 84.2,178.82 U$1.D7
D7S
  Bottom 0.254: U$2.D7 129.29,180.09 165.35,180.09 166.75,178.69 DB15_MAGNET.11
D8  (via drill 0.45)
  Top 0.254: v81.66,185.8 83.53,183.93 83.53,175.68 84.2,175.01 87.38,175.01 U$1.D8
  Bottom 0.254: SRF05_R.1 58.17,191.52 59.44,190.25 77.22,190.25 v81.66,185.8
D9  (via drill 0.45)
  Top 0.254: v83.57,185.8 84.37,185 84.37,177.11 85.2,176.28 U$1.D9
  Bottom 0.254: SRF05_R.2 60.71,192.79 62.21,191.28 78.09,191.28 v83.57,185.8
D9S
  Top 0.254: U$2.D9 129.29,177.55 145.54,177.55 157.86,189.87 DB15_MAGNET.15
D10  (via drill 0.45)
  Top 0.254: U$1.D10 87.38,172.47 83.57,172.47 82.06,173.97 82.06,181.59 v77.85,185.8
  Bottom 0.254: v77.85,185.8 75.18,188.48 49.78,188.48 45.47,192.79 SRF05_M.1
D11  (via drill 0.45)
  Top 0.254: v79.76,185.8 82.8,182.76 82.8,174.51 83.57,173.74 U$1.D11
  Bottom 0.254: SRF05_M.2 48.01,192.79 51.38,189.41 76.15,189.41 v79.76,185.8
D12  (via drill 0.45)
  Top 0.254: v75.31,183.9 75.41,183.9 80.39,178.92 80.39,172.47 82.93,169.93 87.38,169.93 U$1.D12
  Bottom 0.254: SRF05_L.1 32.13,192.15 37.38,186.91 72.3,186.91 v75.31,183.9
D12S
  Bottom 0.254: DB15_MAGNET.1 166.37,171.71 165.61,172.47 134.62,172.47 133.1,170.94 130.81,170.94 U$2.D12
D13  (via drill 0.45)
  Top 0.254: v75.95,185.8 81.23,180.52 81.23,173.54 83.57,171.2 U$1.D13
  Bottom 0.254: SRF05_L.2 34.67,192.79 39.82,187.64 74.11,187.64 v75.95,185.8
D13S  (via drill 0.45)
  Top 0.254: v153.67,183.13 153.67,176.02 150.11,172.47 129.29,172.47 U$2.D13
  Bottom 0.254: DB15_MAGNET.8 161.8,191.26 v153.67,183.13
D24
  Bottom 0.254: RELAY.1 112.27,92.46 102.87,101.85 102.87,149.86 96.77,155.96 U$1.D24
D25
  Bottom 0.254: RELAY.2 112.01,89.92 102.11,99.82 102.11,148.84 96.27,154.69 87.38,154.69 U$1.D25
D26
  Bottom 0.254: RELAY.3 111.76,87.38 101.35,97.79 101.35,147.83 95.76,153.42 U$1.D26
D27
  Bottom 0.254: RELAY.4 110.49,84.84 100.58,94.74 100.58,146.81 95.25,152.15 87.38,152.15 U$1.D27
D28
  Bottom 0.254: RELAY.5 110.24,82.3 99.82,92.71 99.82,145.8 94.74,150.88 U$1.D28
D29
  Bottom 0.254: RELAY.6 109.98,79.76 99.31,90.42 99.31,144.53 94.23,149.61 87.38,149.61 U$1.D29
D30
  Bottom 0.254: RELAY.7 109.47,77.22 98.55,88.14 98.55,143.51 96.77,145.29 96.52,145.54 93.73,148.34 U$1.D30
D31
  Bottom 0.254: RELAY.8 109.98,74.68 98.04,86.61 98.04,142.24 93.47,146.81 87.63,146.81 U$1.D31
D32
  Top 0.254: RECEIVER.1 75.31,31.18 75.31,40.53 JP1.2 77.22,51.71 97.74,72.24 97.74,162.51 102.62,167.39 120.4,167.39 U$1.D32
D33
  Top 0.254: RECEIVER.2 79.64,33.52 78.49,34.67 78.49,41.17 JP1.4 79.76,52.68 98.48,71.4 98.48,161.18 103.42,166.12 U$1.D33
D34
  Top 0.254: RECEIVER.3 82.18,30.98 81.03,32.13 81.03,41.17 JP1.6 82.3,53.65 99.11,70.47 99.11,160.07 103.89,164.85 120.4,164.85 U$1.D34
D35
  Top 0.254: RECEIVER.4 83.57,30.55 83.57,41.17 JP1.8 84.84,54.52 99.75,69.43 99.75,158.8 104.52,163.58 U$1.D35
D36
  Top 0.254: JP1.10 87.3,42.36 | 87.3,42.36 86.11,41.17 86.11,30.55 RECEIVER.5 | U$1.D36 120.4,162.31 105.06,162.31 100.38,157.63 100.38,68.4 87.3,55.32 87.3,42.36
D37
  Top 0.254: RECEIVER.6 89.8,31.62 88.65,32.77 88.65,41.17 JP1.12 89.92,56.26 101.12,67.46 101.12,157 105.16,161.04 U$1.D37
D38
  Top 0.254: JP1.14 92.38,42.36 | 92.38,42.36 91.19,41.17 91.19,34.04 92.34,32.89 RECEIVER.7 | U$1.D38 120.4,159.77 105.36,159.77 101.85,156.26 101.85,66.73 92.38,57.26 92.38,42.36
D39
  Top 0.254: RECEIVER.8 94.88,32.25 93.73,33.4 93.73,41.17 JP1.16 95,58.4 102.49,65.89 102.49,155.33 105.66,158.5 U$1.D39
D40
  Top 0.254: RECEIVER.9 97.54,29.52 97.54,32.13 96.27,33.4 96.27,41.02 97.54,42.29 JP1.18 97.54,59.47 103.12,65.06 103.12,153.79 106.56,157.23 120.4,157.23 U$1.D40
D41
  Top 0.254: RECEIVER.10 99.96,32.89 98.81,34.04 98.81,41.02 100.08,42.29 JP1.20 100.08,60.74 103.86,64.52 103.86,152.65 107.16,155.96 U$1.D41
D42
  Top 0.254: BUZZER.1 107.06,132.46 104.59,134.93 104.59,151.58 107.7,154.69 120.4,154.69 U$1.D42
D43
  Bottom 0.254: U$1.D43 118.49,154.05 111.51,154.05 108.33,150.88 108.33,139.45 DHT.2
D44
  Top 0.254: U$1.D44 121.67,150.48 123.3,148.84 123.3,60.05 120.14,56.9 PUSH_BUTTON.1
D45
  Top 0.254: PUSH_BUTTON.2 119.38,59.44 122.43,62.48 122.43,143.76 120.4,145.8 120.4,149.61 U$1.D45
D48
  Bottom 0.254: OUTPUT_DIGITAL.1 116.59,142.11 U$1.D48
D49
  Bottom 0.254: OUTPUT_DIGITAL.2 119.76,138.18 120.83,139.25 120.83,142.19 117.86,145.16 117.86,149.61 U$1.D49
D50
  Bottom 0.254: U$1.D50 115.32,147.07 115.32,136.88 116.56,135.64 OUTPUT_DIGITAL.3
D51
  Bottom 0.254: OUTPUT_DIGITAL.4 117.07,133.1 114.43,135.74 114.43,146.05 112.78,147.7 112.78,149.61 U$1.D51
D52
  Bottom 0.254: U$1.D52 111.51,147.7 113.54,145.67 113.54,133.73 116.71,130.56 OUTPUT_DIGITAL.5
D53
  Bottom 0.254: OUTPUT_DIGITAL.6 116.46,128.02 112.9,131.57 112.9,144.4 110.24,147.07 110.24,149.61 U$1.D53
FAN
  Bottom 0.813: FANRIGHT.P$2 6.3,2.92 91.5,2.92 FANLEFT.P$2
GND
  pour Bottom (isolate 0.406): 0,203.96 3.81,203.96 180.09,203.96 180.09,0 0.25,0 0,0
  pour Top (isolate 0.406): 0,166.12 0,0 180.09,0 180.09,203.96 0,203.96
GND_B
  Bottom 0.406: BINDING.2 111.39,36.46 110.87,35.94 104.03,35.94 JP1.33
N$3
  Bottom 0.406: 6.8K.1 93.16,133.78 30K.2
N$5
  Bottom 0.406: OUTPUT_INVERTER.7 BOARD_TO_INVERTER.1
N$6
  Bottom 0.406: OUTPUT_INVERTER.6 BOARD_TO_INVERTER.2
N$7
  Bottom 0.406: OUTPUT_INVERTER.5 BOARD_TO_INVERTER.3
N$8
  Bottom 0.406: OUTPUT_INVERTER.4 BOARD_TO_INVERTER.4
N$9
  Bottom 0.406: OUTPUT_INVERTER.3 BOARD_TO_INVERTER.5
N$10
  Bottom 0.406: OUTPUT_INVERTER.2 BOARD_TO_INVERTER.6
N$11
  Bottom 0.406: OUTPUT_INVERTER.1 BOARD_TO_INVERTER.7
RX1
  Bottom 0.254: APC220.2 168.66,155.96 167.39,157.23 96.01,157.23 90.93,162.31 87.38,162.31 U$1.D19
RX2
  Bottom 0.254: NEXTION.1 82.93,146.43 82.93,158.5 83.57,159.13 83.57,165.48 84.2,166.12 U$1.D17
RX3
  Bottom 0.254: MASTER_SLAVE.1 82.3,165.1 82.3,167.39 83.57,168.66 U$1.D15 87.38,169.93 129.29,169.93 U$2.D14
SCL
  Top 0.254: U$1.D21 84.2,161.04 78.49,166.75 74.68,166.75 72.14,169.29 72.14,187.07 71.5,187.71 SRF08.1
SDA
  Top 0.254: U$1.D20 87.38,162.31 84.84,162.31 79.12,168.02 74.68,168.02 74.04,168.66 SRF08.2
TX1
  Bottom 0.254: U$1.D18 111.76,163.58 115.57,159.77 169.93,159.77 APC220.1
TX2
  Bottom 0.254: U$1.D16 87.38,164.85 84.84,164.85 84.2,164.21 84.2,142.62 82.3,140.72 NEXTION.2
TX3
  Bottom 0.254: MASTER_SLAVE.2 79.38,158.5 82.93,162.05 82.93,166.12 84.2,167.39 87.38,167.39 U$1.D14 116.59,168.66 117.86,167.39 126.75,167.39 U$2.D15
VIN
  Top 0.406: U$1.VIN.2 U$1.VIN.1 U$2.VIN.2 U$2.VIN.1

### Text on the board
tNames: D2 | D4 | GND | 5V | D3 | D5 | GND | 5V | D12 | D13 | GND | 5V | D10 | D11 | GND | 5V | D8 | D9 | GND | 5V | SCL | SDA | GND | 5V | 5V GND RX1 TX1 | 24V GND | 5V | D43 | GND | D48 | D49 | D50 | D51 | D52 | D53 | A3 | A2 | A1 | A0 | A0 | GND | GND | 5V | D24 | 24V | D25 | D26 | D27 | D28 | D29 | D30 | D31 | GND | 5V | 12V GND | 5V GND | D44 D45 GND 5V | GND | 12V | GND | 12V | GND | 5V | GND | 5V | 5V | GND | D32 | D33 | D34 | D35 | D36 | D37 | D38 | D39 | D40 | D41 | GND | 5V | GND | 12V | SWITCH | GND | 24V | GND | 24V | GND | 24V | EMERGENCY | SWITCH | FUSE | FUSE | FAN GND | GND | 12V GND | FAN | 12V GND 12V GND
bNames: D6 | D7 | GND | 5V | RX3 | TX3 | GND | RX2 | TX2 | GND | 5V | D5 | D4 | GND | 5V